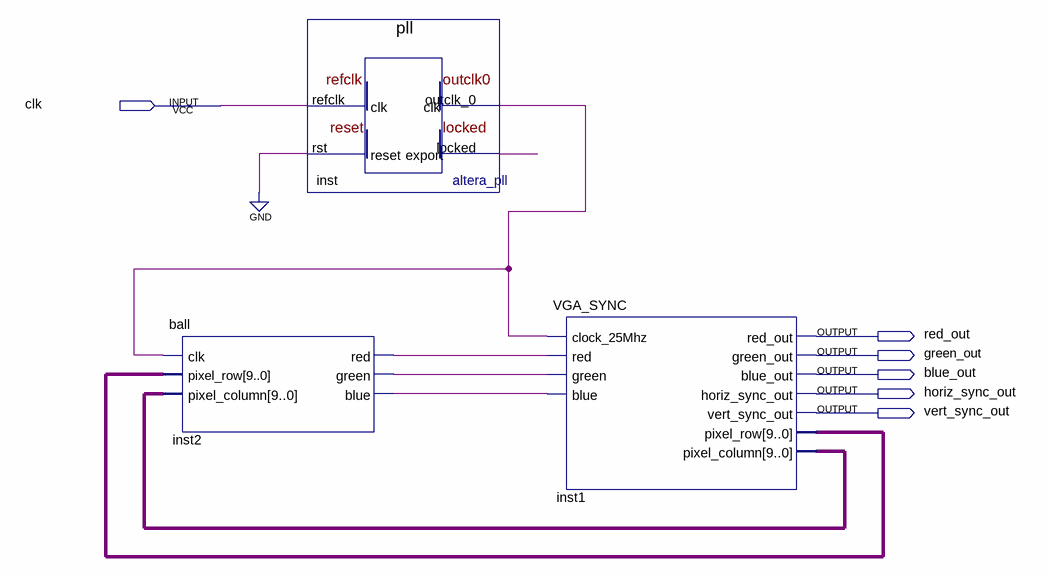
[diagram p0: schematic sheet]
// Quartus schematic ball_example.bdf as structural Verilog: 3 symbols, 6 pins
module ball_example (
  input  clk,
  output red_out,
  output green_out,
  output blue_out,
  output horiz_sync_out,
  output vert_sync_out
);

  wire inst2_blue, inst2_green, inst2_red, inst_locked, inst_outclk_0;
  wire [9:0] inst1_pixel_column, inst1_pixel_row;

  ball inst2 (
    .clk(inst_outclk_0), .pixel_row(inst1_pixel_row), .pixel_column(inst1_pixel_column), .red(inst2_red),
    .green(inst2_green), .blue(inst2_blue));
  pll inst (.refclk(clk), .rst(1'b0), .outclk_0(inst_outclk_0), .locked(inst_locked));
  VGA_SYNC inst1 (
    .clock_25Mhz(inst_outclk_0), .red(inst2_red), .green(inst2_green), .blue(inst2_blue), .red_out(red_out),
    .green_out(green_out), .blue_out(blue_out), .horiz_sync_out(horiz_sync_out),
    .vert_sync_out(vert_sync_out), .pixel_row(inst1_pixel_row), .pixel_column(inst1_pixel_column));
endmodule
